# EAGLE design main_2 (EAGLE 7.1.0)
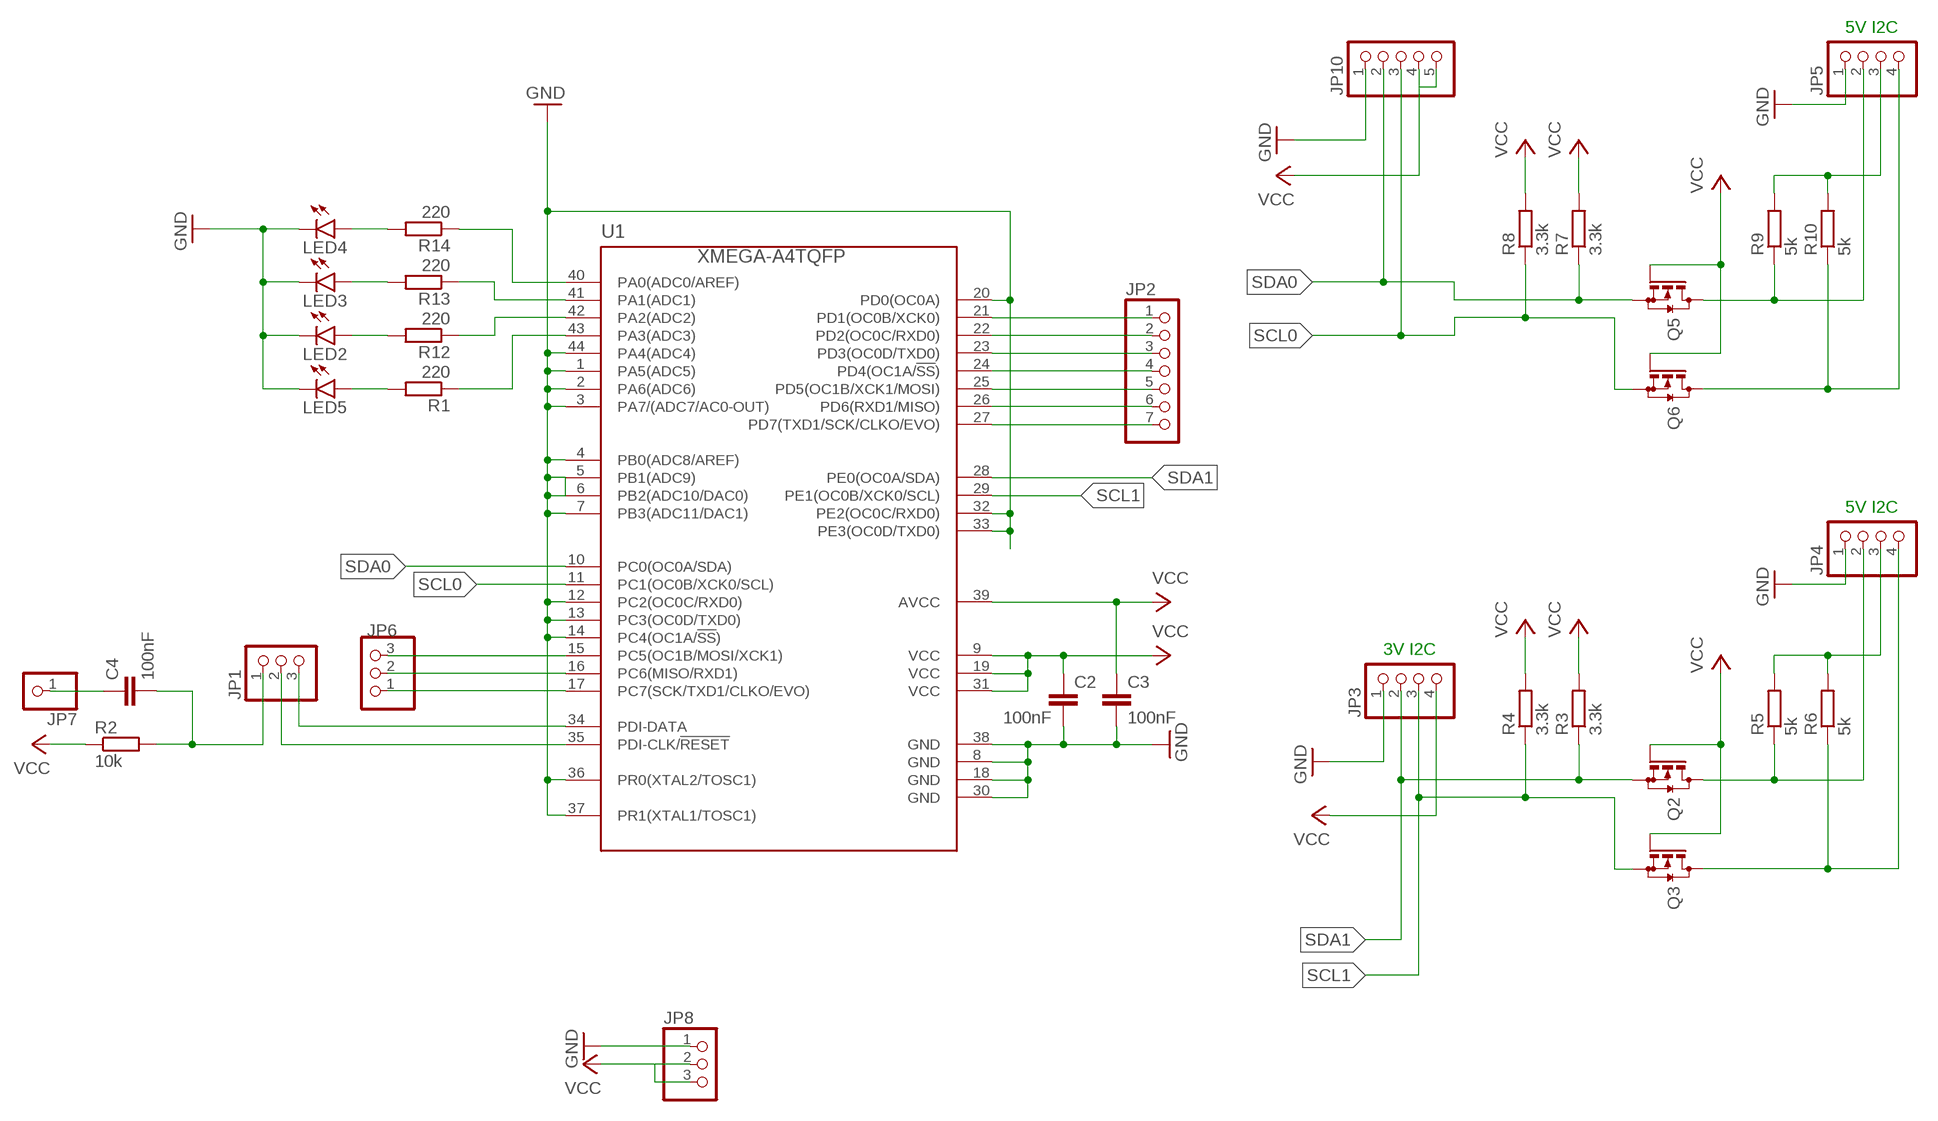
[diagram p0: schematic, sheet 1]

## Parts
C2  100nF  C  [C0805]
C3  100nF  C  [C0805]
C4  100nF  C  [C0805]
JP1  PINHD-1X3  [1X03]
JP2  PINHD-1X7  [1X07]
JP3  PINHD-1X4  [1X04]
JP4  PINHD-1X4  [1X04]
JP5  PINHD-1X4  [1X04]
JP6  PINHD-1X3  [1X03]
JP7  PINHD-1X1  [1X01]
JP8  PINHD-1X3  [1X03]
JP10  PINHD-1X5  [1X05]
LED2  LED1206  [LED-1206]
LED3  LED1206  [LED-1206]
LED4  LED1206  [LED-1206]
LED5  LED1206  [LED-1206]
Q2  BSS123  [SOT23]
Q3  BSS123  [SOT23]
Q5  BSS123  [SOT23]
Q6  BSS123  [SOT23]
R1  220  R  [R0805]
R2  10k  R  [R0805]
R3  3.3k  R  [R0805]
R4  3.3k  R  [R0805]
R5  5k  R  [R0805]
R6  5k  R  [R0805]
R7  3.3k  R  [R0805]
R8  3.3k  R  [R0805]
R9  5k  R  [R0805]
R10  5k  R  [R0805]
R12  220  R  [R0805]
R13  220  R  [R0805]
R14  220  R  [R0805]
U1  XMEGA-A4TQFP  [TQFP44]

## Nets
GND: C2.2 C3.2 JP3.1 JP4.1 JP5.1 JP8.1 JP10.1 LED2.C LED3.C LED4.C LED5.C U1.1(PA5(ADC5)) U1.2(PA6(ADC6)) U1.3(PA7/(ADC7/AC0-OUT)) U1.4(PB0(ADC8/AREF)) U1.5(PB1(ADC9)) U1.6(PB2(ADC10/DAC0)) U1.7(PB3(ADC11/DAC1)) U1.8(GND) U1.12(PC2(OC0C/RXD0)) U1.13(PC3(OC0D/TXD0)) U1.14(PC4(OC1A/!SS!)) U1.18(GND) U1.20(PD0(OC0A)) U1.30(GND) U1.32(PE2(OC0C/RXD0)) U1.33(PE3(OC0D/TXD0)) U1.36(PR0(XTAL2/TOSC1)) U1.37(PR1(XTAL1/TOSC1)) U1.38(GND) U1.44(PA4(ADC4))
N$1: C4.2 JP1.1 R2.2
N$2: JP1.2 U1.35(PDI-CLK/!RESET)
N$4: JP6.1 U1.17(PC7(SCK/TXD1/CLKO/EVO))
N$5: JP2.5 U1.25(PD5(OC1B/XCK1/MOSI))
N$6: JP2.6 U1.26(PD6(RXD1/MISO))
N$7: JP2.3 U1.23(PD3(OC0D/TXD0))
N$8: JP2.2 U1.22(PD2(OC0C/RXD0))
N$9: JP4.2 Q2.3(D) R5.1
N$10: JP4.4 Q3.3(D) R6.1
N$11: JP1.3 U1.34(PDI-DATA)
N$12: JP2.1 U1.21(PD1(OC0B/XCK0))
N$13: JP2.4 U1.24(PD4(OC1A/!SS!))
N$14: JP2.7 U1.27(PD7(TXD1/SCK/CLKO/EVO))
N$15: JP4.3 R5.2 R6.2
N$16: JP6.2 U1.16(PC6(MISO/RXD1))
N$17: JP6.3 U1.15(PC5(OC1B/MOSI/XCK1))
N$18: JP5.2 Q5.3(D) R9.1
N$19: JP5.4 Q6.3(D) R10.1
N$20: JP5.3 R9.2 R10.2
N$21: R1.1 U1.43(PA3(ADC3))
N$22: R12.1 U1.42(PA2(ADC2))
N$23: R13.1 U1.41(PA1(ADC1))
N$24: R14.1 U1.40(PA0(ADC0/AREF))
N$25: LED5.A R1.2
N$26: LED2.A R12.2
N$27: LED3.A R13.2
N$28: LED4.A R14.2
RESET: C4.1 JP7.1
SCL0: JP10.3 Q6.2(S) R8.1 U1.11(PC1(OC0B/XCK0/SCL))
SCL1: JP3.3 Q3.2(S) R4.1 U1.29(PE1(OC0B/XCK0/SCL))
SDA0: JP10.2 Q5.2(S) R7.1 U1.10(PC0(OC0A/SDA))
SDA1: JP3.2 Q2.2(S) R3.1 U1.28(PE0(OC0A/SDA))
VCC: C2.1 C3.1 JP3.4 JP8.2 JP8.3 JP10.4 JP10.5 Q2.1(G) Q3.1(G) Q5.1(G) Q6.1(G) R2.1 R3.2 R4.2 R7.2 R8.2 U1.9(VCC) U1.19(VCC) U1.31(VCC) U1.39(AVCC)

## Notes on the sheet
- 5V I2C
- 5V I2C
- 3V I2C

## Library data of the parts
C2-C4 = eagle-ltspice:C: CAPACITOR, European symbol; SPICEMODEL: NONE; SPICEPREFIX: C
JP1 JP6 JP8 = pinhead:PINHD-1X3: PIN HEADER
JP2 = pinhead:PINHD-1X7: PIN HEADER
JP3-JP5 = pinhead:PINHD-1X4: PIN HEADER
JP7 = pinhead:PINHD-1X1: PIN HEADER
JP10 = pinhead:PINHD-1X5: PIN HEADER
LED2-LED5 = SparkFun-LED:LED: LEDs Standard schematic elements and footprints for 5mm, 3mm, 1206, and 0603 sized LEDs. 5mm - Spark Fun Electronics SKU : COM-00529 (and others)
Q2 Q3 Q5 Q6 = transistor-small-signal:BSS123: N-CHANNEL MOS FET
R1-R10 R12-R14 = eagle-ltspice:R: RESISTOR, European symbol; SPICEMODEL: NONE; SPICEPREFIX: R
U1 = avr-7:XMEGA-A4: Atmel XMega A4 series processor

## Board
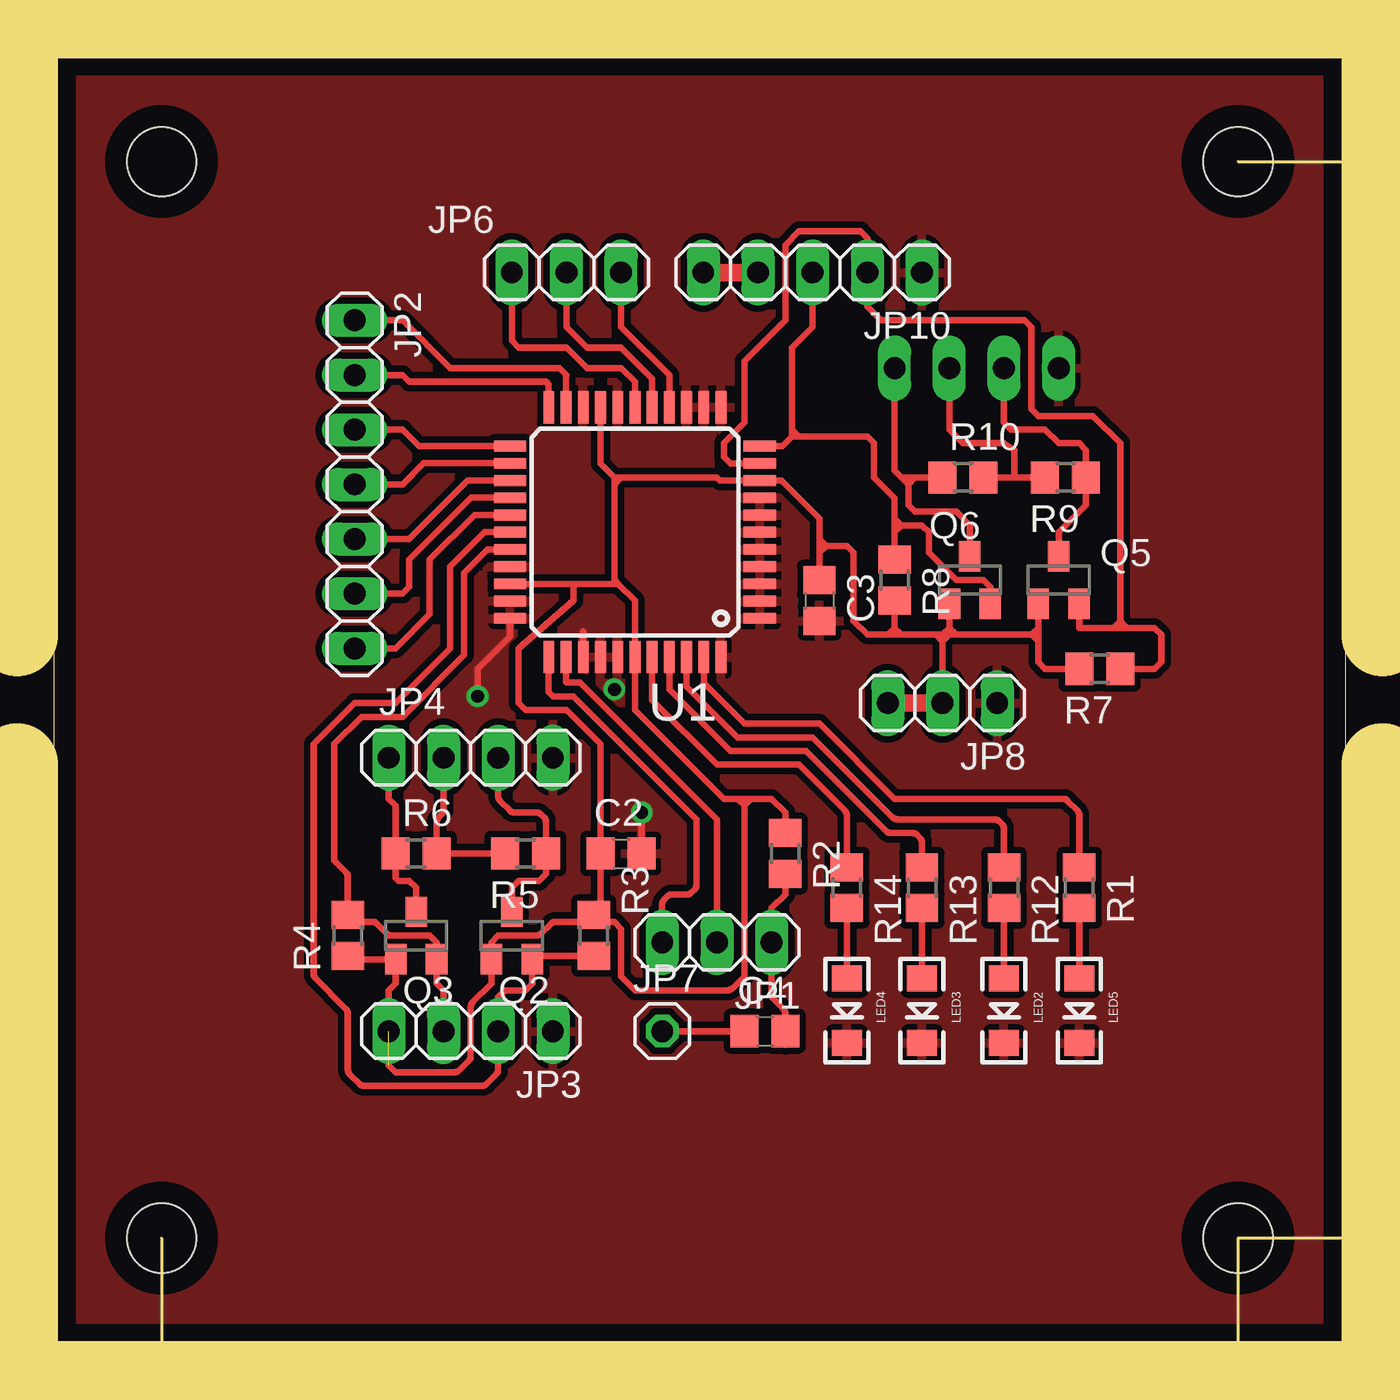
[diagram p1: board, top side]
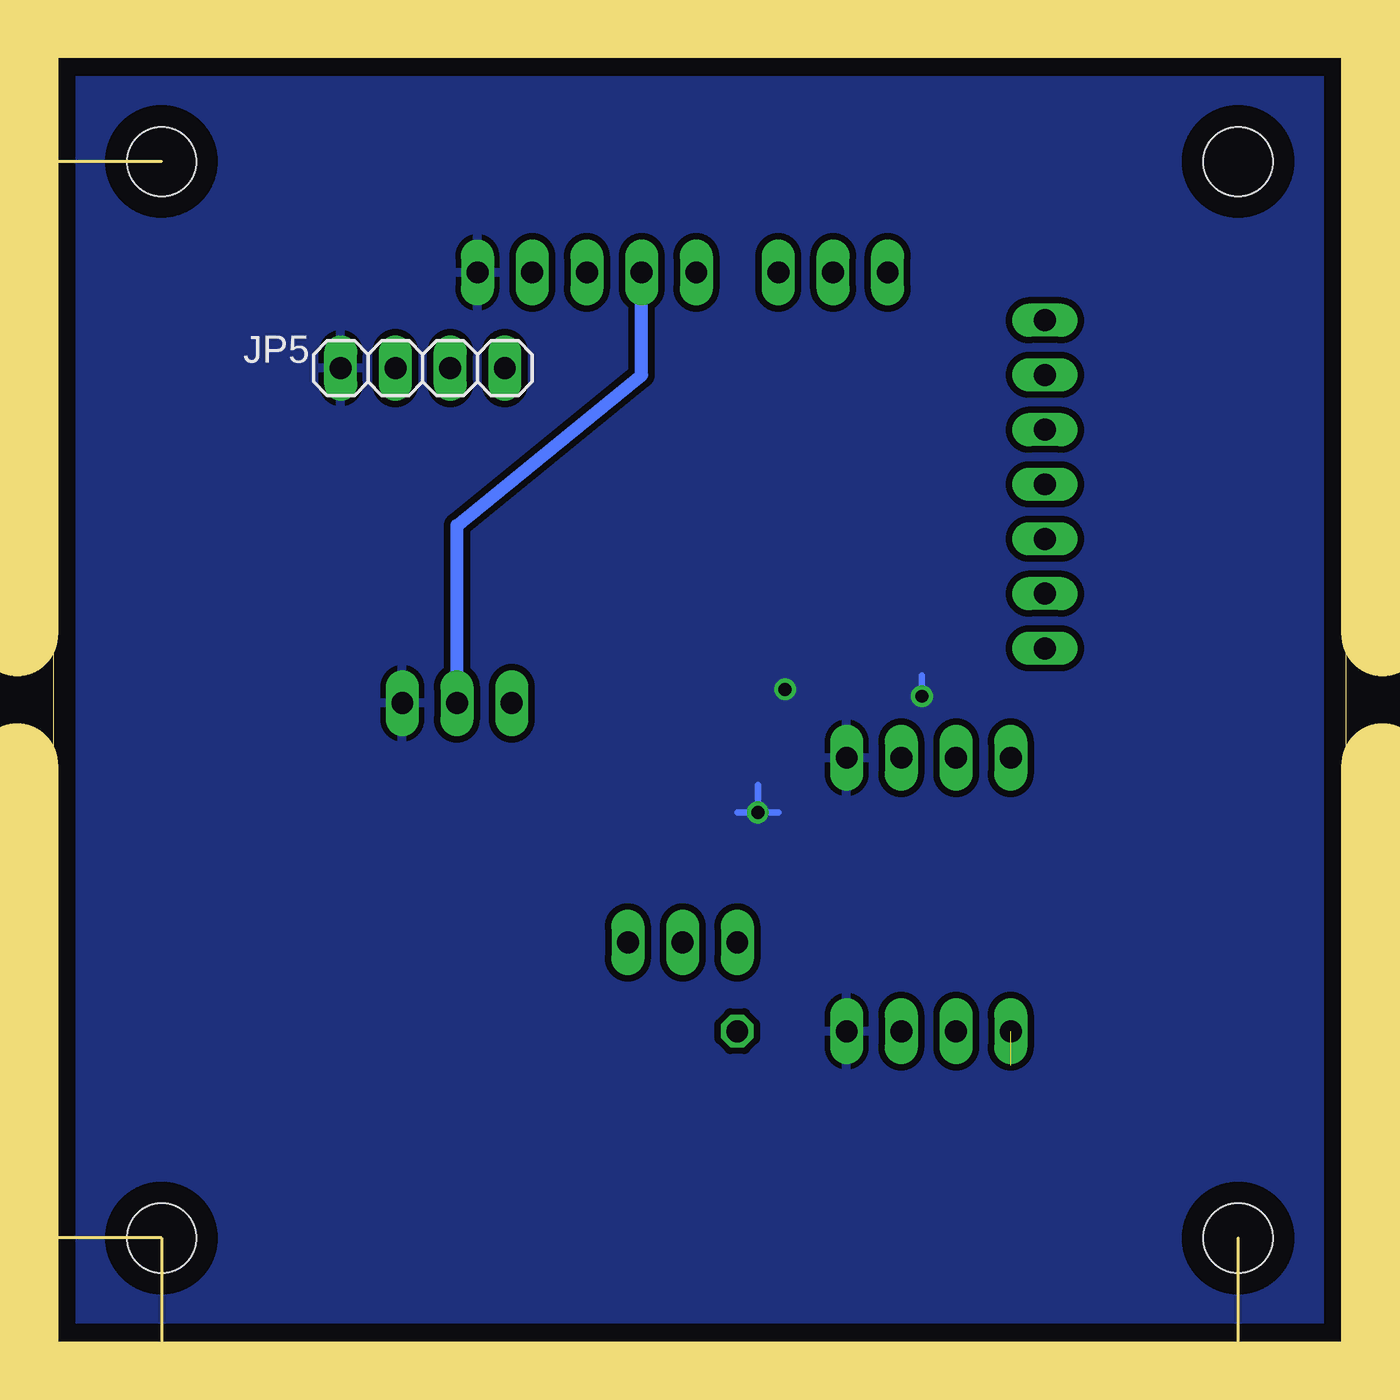
[diagram p2: board, bottom side, seen from below]

Size 60 x 60 mm. Coordinates in mm from the lower left corner, seen from the top.
Outline: 0,0 60,0 60,60 0,60 0,0
Copper layers (1*16): Top 0.035mm / dielectric 1.5mm / Bottom 0.035mm
Design rules "default *": minimum track width 10mil, minimum drill 24mil, track to track 12mil, track to pad 8mil, pad to pad 8mil, via to via 8mil, smd to smd 8mil, copper to edge 40mil, drill to drill 8mil, minimum pad ring 10mil, minimum via ring 8mil, stop-mask expansion 4mil, vias tented up to drill 0mil, thermal gap 10mil
Holes 3.2 mm at 5,55 55,55 55,5 5,5
Milling: area 5,-11.7 to 6.5,-11.1; area 53.5,-11.7 to 55,-11.1; area 29,-11 to 31,-9.8; area 74.6,5 to 75.2,6.5; area 74.6,53.5 to 75.2,55; area 73.3,29 to 74.5,31; area 83.5,0 to 84.1,1.5; area 83.5,58.5 to 84.1,60; area 82.1,29 to 83.4,31; area 0,-20.6 to 1.5,-20; area 58.5,-20.6 to 60,-20; area 29,-19.9 to 31,-18.7; 18 lines

### Footprints (pad centres in the part's own frame; a part is rotated, then mirrored left to right if it is on the bottom)
C0805 = smd 1.3 x 1.5: 1 -0.95,0; 2 0.95,0
1X03 = drill 1.016 long: 1 -2.54,0; 2 0,0; 3 2.54,0
1X07 = drill 1.016 long: 1 -7.62,0; 2 -5.08,0; 3 -2.54,0; 4 0,0; 5 2.54,0; 6 5.08,0; 7 7.62,0
1X04 = drill 1.016 long: 1 -3.81,0; 2 -1.27,0; 3 1.27,0; 4 3.81,0
1X01 = drill 1.016 octagon: 1 0,0
1X05 = drill 1.016 long: 1 -5.08,0; 2 -2.54,0; 3 0,0; 4 2.54,0; 5 5.08,0
LED-1206 = smd 1.2 x 1.4: A -1.5,0; C 1.5,0
SOT23 = smd 1 x 1.4: 1 -0.95,-1.1; 2 0.95,-1.1; 3 0,1.1
R0805 = smd 1.3 x 1.5: 1 -0.95,0; 2 0.95,0
TQFP44 = smd 1.5 x 0.5: 1 -5.8,4; 2 -5.8,3.2; 3 -5.8,2.4; 4 -5.8,1.6; 5 -5.8,0.8; 6 -5.8,0; 7 -5.8,-0.8; 8 -5.8,-1.6; 9 -5.8,-2.4; 10 -5.8,-3.2; 11 -5.8,-4; 23 5.8,-4; 24 5.8,-3.2; 25 5.8,-2.4; 26 5.8,-1.6; 27 5.8,-0.8; 28 5.8,0; 29 5.8,0.8; 30 5.8,1.6; 31 5.8,2.4; 32 5.8,3.2; 33 5.8,4 | smd 0.5 x 1.5: 12 -4,-5.8; 13 -3.2,-5.8; 14 -2.4,-5.8; 15 -1.6,-5.8; 16 -0.8,-5.8; 17 0,-5.8; 18 0.8,-5.8; 19 1.6,-5.8; 20 2.4,-5.8; 21 3.2,-5.8; 22 4,-5.8; 34 4,5.8; 35 3.2,5.8; 36 2.4,5.8; 37 1.6,5.8; 38 0.8,5.8; 39 0,5.8; 40 -0.8,5.8; 41 -1.6,5.8; 42 -2.4,5.8; 43 -3.2,5.8; 44 -4,5.8

### Placement (x,y rotation side)
C2  26.35,22.86 0 top
C3  35.56,34.61 270 top
C4  33.02,14.61 0 top
JP1  30.8,18.73 180 top
JP2  13.97,40.01 270 top
JP3  19.37,14.61 180 top
JP4  19.37,27.3 180 top
JP5  42.86,45.4 0 bottom
JP6  23.81,49.85 0 top
JP7  28.26,14.61 0 top
JP8  41.27,29.84 180 top
JP10  35.24,49.85 180 top
LED2  44.13,15.56 270 top
LED3  40.32,15.56 270 top
LED4  36.83,15.56 270 top
LED5  47.62,15.56 270 top
Q2  21.27,19.05 0 top
Q3  16.83,19.05 0 top
Q5  46.67,35.56 0 top
Q6  42.55,35.56 0 top
R1  47.62,21.27 270 top
R2  33.97,22.86 270 top
R3  25.08,19.05 90 top
R4  13.65,19.05 270 top
R5  21.91,22.86 180 top
R6  16.83,22.86 0 top
R7  48.58,31.43 180 top
R8  39.05,35.56 270 top
R9  46.99,40.32 180 top
R10  42.23,40.32 0 top
R12  44.13,21.27 270 top
R13  40.32,21.27 270 top
R14  36.83,21.27 270 top
U1  26.99,37.78 180 top

### Tracks (layer width: path | path; a pad name or v marks a point on that pad's centre or on a via)
GND  (via drill 0.6)
  Top 0.305: U1.36 24.59,33.16 | U1.33 21.19,32.94 19.68,31.43 v19.68,30.16 | C2.2 v27.3,24.76 v27.3,24.77
  Bottom 0.305: v27.3,24.77 27.3,26.04 | v19.68,30.16 19.68,31.11 | v27.3,24.77 28.26,24.77 | v27.3,24.77 26.35,24.77
  other vias: 26.04,30.48
  pour Top: -3.81,63.18 -3.17,-2.86 62.87,-2.22 61.91,62.87
  pour Bottom: -4.76,-6.67 64.77,-6.03 64.77,66.99 -5.71,65.72
N$1
  Top 0.305: C4.2 33.97,13.97 33.97,15.43 arc45 33.88,15.65 33.43,16.1 arc-45 33.34,16.32 JP1.1 33.34,20.32 33.97,20.95 R2.2
N$2
  Top 0.305: JP1.2 30.8,24.45 24.45,30.8 23.81,30.8 23.79,30.82 U1.35
N$4
  Top 0.305: JP6.1 21.27,46.67 21.59,46.35 23.81,46.35 24.77,45.4 26.35,45.4 26.99,44.77 U1.17
N$5
  Top 0.305: JP2.5 16.51,37.47 19.23,40.18 U1.25
N$6
  Top 0.305: JP2.6 16.19,34.92 16.51,35.24 16.51,36.51 19.38,39.38 U1.26
N$7
  Top 0.305: U1.23 16.95,41.78 16.19,42.55 JP2.3
N$8
  Top 0.305: U1.22 22.99,44.64 22.86,44.77 16.51,44.77 16.19,45.09 JP2.2
N$9
  Top 0.305: JP4.2 20.64,25.53 arc45 20.73,25.31 21.18,24.86 arc45 21.4,24.77 22.41,24.77 arc-45 22.64,24.67 22.77,24.54 arc-45 22.86,24.32 R5.1 22.86,21.91 22.54,21.59 21.59,21.59 21.27,21.27 Q2.3
N$10
  Top 0.305: JP4.4 15.56,25.4 15.88,25.08 R6.1 15.88,21.72 16.01,21.59 16.51,21.59 16.83,21.27 Q3.3
N$11
  Top 0.305: JP1.3 28.26,20.51 arc-45 28.35,20.73 28.48,20.86 arc-45 28.71,20.95 29.4,20.95 arc45 29.62,21.05 29.75,21.18 arc45 29.84,21.4 29.84,24.45 24.13,30.16 23.18,30.16 22.99,30.35 U1.34
N$12
  Top 0.305: U1.21 23.79,45.06 23.81,45.09 23.5,45.4 18.41,45.4 16.19,47.62 JP2.1
N$13
  Top 0.305: U1.24 17.17,40.98 16.19,40.01 JP2.4
N$14
  Top 0.305: JP2.7 15.88,32.38 17.46,33.97 17.46,36.51 19.53,38.58 U1.27
N$15
  Top 0.305: JP4.3 18.1,24.9 arc-45 18,24.67 17.87,24.54 arc45 17.78,24.31 R6.2 R5.2
N$16
  Top 0.305: U1.16 27.79,44.92 26.35,46.35 24.77,46.35 23.81,47.31 JP6.2
N$17
  Top 0.305: U1.15 28.59,45.07 26.35,47.31 JP6.3
N$18
  Top 0.305: Q5.3 46.67,37.78 47.94,39.05 R9.1 47.94,41.59 47.62,41.91 46.67,41.91 46.04,42.55 44.45,42.55 44.13,42.86 JP5.2
N$19
  Top 0.305: Q6.3 42.55,38.1 41.91,38.73 40.01,38.73 39.69,39.05 39.69,40.01 | R10.1 40.01,40.32 | JP5.4 39.05,40.64 39.37,40.32 | 39.37,40.32 39.69,40.32 | 39.69,40.32 40.01,40.32 | 39.69,40.01 39.69,40.32 | 40.01,40.32 39.69,40.01 | 39.69,40.01 39.37,40.32
N$20
  Top 0.305: R9.2 44.6,40.32 | 44.6,40.32 R10.2 | JP5.3 41.59,42.55 42.23,41.91 44.13,41.91 44.6,41.59 44.6,40.32
N$21
  Top 0.305: R1.1 47.62,24.63 arc45 47.53,24.86 47.08,25.31 arc45 46.86,25.4 39.05,25.4 35.56,28.89 32.07,28.89 30.19,30.77 U1.43
N$22
  Top 0.305: R12.1 44.13,24 arc45 44.04,24.22 43.91,24.36 arc45 43.68,24.45 39.18,24.45 arc-45 38.96,24.54 35.24,28.26 31.75,28.26 29.39,30.62 U1.42
N$23
  Top 0.305: R13.1 40.32,23.36 arc45 40.23,23.59 40.1,23.72 arc45 39.87,23.81 38.87,23.81 arc-45 38.64,23.91 34.92,27.62 31.43,27.62 28.59,30.47 U1.41
N$24
  Top 0.305: R14.1 36.83,24.63 arc45 36.74,24.86 34.61,26.99 30.8,26.99 27.79,30 U1.40
N$25
  Top 0.305: LED5.A R1.2
N$26
  Top 0.305: LED2.A R12.2
N$27
  Top 0.305: LED3.A R13.2
N$28
  Top 0.305: LED4.A R14.2
RESET
  Top 0.305: C4.1 JP7.1
SCL0
  Top 0.305: R8.1 39.05,36.83 39.05,37.78 | 40.64,36.83 | 40.64,36.83 41.91,35.56 43.18,35.56 43.5,35.24 Q6.2 43.49,34.93 43.5,34.92 | 39.05,37.78 39.05,38.1 | 39.05,38.1 39.05,38.42 | U1.11 33.84,41.78 34.29,42.23 | 34.61,42.23 34.29,42.23 | 34.29,42.23 34.29,42.55 | 34.29,42.55 34.29,46.35 35.24,47.31 JP10.3 | 40.64,36.83 40.64,37.46 40.64,37.47 40.64,37.78 40.32,38.1 39.37,38.1 | 39.37,38.1 39.05,38.1 | 39.05,37.78 39.37,38.1 | 39.37,38.1 39.05,38.42 | 34.61,42.23 34.29,42.55 | 34.61,42.23 37.78,42.23 38.1,41.91 38.1,40.32 39.05,39.37 39.05,38.42
SCL1
  Top 0.305: 18.1,17.63 Q3.2 | Q3.2 17.78,18.1 | 16.7,19.05 15.69,19.05 arc-45 15.46,19.14 15.02,19.59 arc45 14.79,19.68 | 14.79,19.68 13.65,19.68 | 13.65,19.68 13.33,19.68 R4.1 13.65,21.78 arc45 13.56,22 13.26,22.3 | 14.79,19.68 14.92,19.68 15.56,19.05 17.46,19.05 17.78,18.73 Q3.2 | 13.65,19.68 13.65,21.91 13.02,22.54 13.02,27.94 14.29,29.21 16.19,29.21 19.05,32.07 19.05,35.88 20.16,36.98 U1.29 | JP3.3 18.1,16.51 17.78,16.83 Q3.2
SDA0
  Top 0.305: U1.10 32.76,40.96 31.43,40.96 31.11,41.27 31.11,41.91 32.07,42.86 32.07,45.72 33.97,47.62 33.97,51.12 34.61,51.75 37.47,51.75 37.78,51.44 JP10.2 37.78,48.26 38.42,47.62 45.09,47.62 45.4,47.31 45.4,43.5 45.72,43.18 48.26,43.18 49.53,41.91 49.53,33.66 | Q5.2 47.62,33.34 49.21,33.34 | 49.21,33.34 49.85,33.34 | 49.85,33.34 51.12,33.34 51.44,33.02 51.44,31.75 51.12,31.43 R7.1 | 49.53,33.66 49.85,33.34 | 49.53,33.66 49.21,33.34
SDA1
  Top 0.305: R3.1 22.37,18.1 Q2.2 22.22,16.83 22.23,16.83 21.91,16.51 20.95,16.51 20.64,16.19 JP3.2 20.64,12.83 arc-45 20.55,12.61 20.09,12.16 arc-45 19.87,12.06 14.42,12.06 arc-45 14.2,12.16 13.74,12.61 arc-45 13.65,12.83 13.65,15.43 arc45 13.56,15.65 12.16,17.05 arc-45 12.06,17.28 12.06,27.94 13.97,29.84 15.88,29.84 18.41,32.38 18.41,36.2 20,37.78 U1.28
VCC  (1 unrouted)
  Top 0.305: Q3.1 13.17,17.95 R4.2 | Q2.1 20.32,17.63 20.32,16.83 19.46,15.97 arc45 19.37,15.74 19.37,13.44 arc-45 19.29,13.26 18.81,12.77 arc-45 18.63,12.7 15.88,12.7 15.56,13.02 15.56,16.51 15.88,16.83 Q3.1 | 16.19,17.64 Q3.1 | Q2.1 20.32,18.1 | 24.77,19.68 23.31,19.68 arc45 23.09,19.59 22.64,19.14 arc-45 22.41,19.05 20.64,19.05 20.32,18.73 Q2.1 | 24.77,19.68 R3.2 | U1.19 25.39,40.97 26.04,40.32 | 24.77,19.68 24.77,19.69 | 24.77,19.69 25.4,20.32 C2.1 25.4,27.94 23.81,29.53 21.91,29.53 21.59,29.84 21.59,32.38 24.13,34.61 24.13,35.38 | U1.31 24.13,35.38 | 24.13,35.38 26.21,35.38 | 26.21,35.38 26.99,34.61 U1.39 26.99,29.53 31.11,25.4 31.75,25.4 | 26.04,40.32 26.04,40.01 | 26.04,40.01 26.04,35.56 26.21,35.38 | 26.04,40.32 26.35,40.32 | 26.35,40.32 30.8,40.32 30.94,40.18 U1.9 33.8,40.18 35.56,38.42 35.56,37.47 | 32.07,25.08 32.07,17.14 31.52,16.6 arc-45 31.3,16.51 26.99,16.51 26.35,17.14 26.35,19.37 26.03,19.69 24.77,19.69 | 32.07,25.08 32.07,25.4 | 33.53,23.5 arc45 33.75,23.59 R2.1 33.97,24.77 33.34,25.4 32.38,25.4 | 41.27,33.02 41.59,33.02 | 45.72,33.34 Q5.1 | Q5.1 45.72,34.61 Q5.1 | Q6.1 41.59,33.02 | 39.05,34.29 R8.2 39.05,33.34 | 41.59,33.02 41.91,33.02 | 41.91,33.02 45.4,33.02 | 45.4,33.02 45.72,33.34 | 32.38,25.4 32.07,25.4 | 32.07,25.4 31.75,25.4 | C3.1 35.56,36.83 | 35.56,37.47 35.56,37.15 | 35.56,37.15 35.56,36.83 | 45.72,33.34 45.72,32.7 | 45.72,32.7 45.72,31.75 46.04,31.43 R7.2 | 45.4,33.02 45.72,32.7 | 41.27,33.02 40.96,33.02 | 40.96,33.02 39.37,33.02 | 39.37,33.02 39.05,33.34 | 35.88,37.15 36.83,37.15 37.15,36.83 37.15,33.66 37.78,33.02 38.73,33.02 | 35.88,37.15 35.56,37.15 | 35.56,36.83 35.88,37.15
  Top 0.305: 35.88,37.15 35.56,37.47 | 38.73,33.02 39.05,33.34 | 38.73,33.02 39.37,33.02 | 41.91,33.02 41.59,33.34 41.27,33.02 | Q3.1 | 32.07,25.08 31.75,25.4 | 32.07,25.08 32.38,25.4 | 26.35,40.32 26.04,40.01 | JP8.2 41.27,32.7 | 41.27,32.7 41.27,33.02 | 40.96,33.02 41.27,32.7 | 41.27,32.7 41.59,33.02
  Top 0.813: JP8.2 JP8.3 | JP10.4 JP10.5
  Bottom 0.61: JP8.2 41.27,38.1 32.7,45.09 JP10.4

### Text on the board
tDocu: sck/17 | miso/16 | mosi/15 | vcc | scl0/11 | sda0/10 | gnd | xck0/21 | rxd0/22 | txd0/23 | ss/24 | mosi/25 | miso/26 | sck/27 | scl0 | 5v | sda0 | gnd | vcc | scl1 | sda1 | gnd | pdi-data | pdi-clk | scl1 | 5v | gnd | vcc | gnd | sda1 | rst